# Altium schematic sheet main.SchDoc: Project SHED
size A4; DrawnBy: ultralyj; DocumentNumber: 1; Revision: 0.1; SheetNumber: 1; SheetTotal: 2
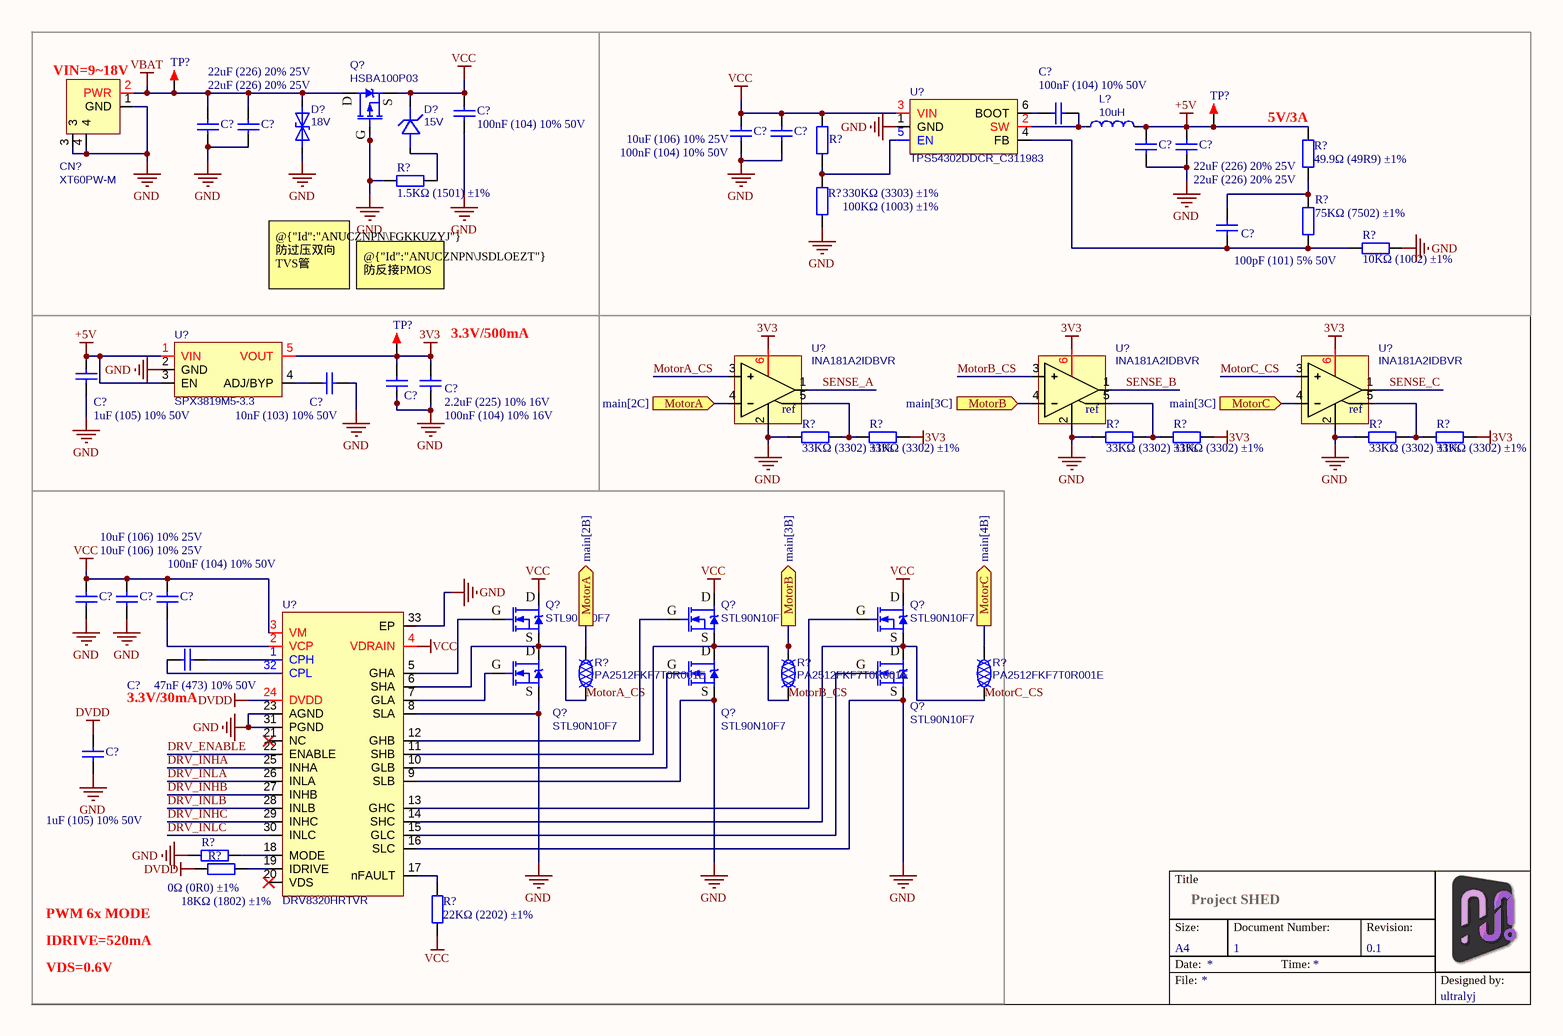
[diagram p0: main.SchDoc]

## Parts
(Parts that share a designator on the sheet are numbered #1, #2 ... from top to bottom, then left to right.)
C?#1  100nF (104) 10% 50V  [0603_C]
C?#2  100nF (104) 10% 50V  [0603_C]
C?#3  22uF (226) 20% 25V  [0805_C]
C?#4  22uF (226) 20% 25V  [0805_C]
C?#5  10uF (106) 10% 25V  [0805_C]
C?#6  100nF (104) 10% 50V  [0603_C]
C?#7  22uF (226) 20% 25V  [0805_C]
C?#8  22uF (226) 20% 25V  [0805_C]
C?#9  100pF (101) 5% 50V  [0402_C]
C?#10  10nF (103) 10% 50V  [0402_C]
C?#11  1uF (105) 10% 50V  [0603_C]
C?#12  100nF (104) 10% 16V  [0402_C]
C?#13  2.2uF (225) 10% 16V  [0603_C]
C?#14  10uF (106) 10% 25V  [0805_C]
C?#15  10uF (106) 10% 25V  [0805_C]
C?#16  100nF (104) 10% 50V  [0603_C]
C?#17  47nF (473) 10% 50V  [0603_C]
C?#18  1uF (105) 10% 50V  [0603_C]
CN?  XT60PW-M  [CONN-TH_XT60PW-M]
D?#1  18V  [SMB_L4.6-W3.6-LS5.3-BI]
D?#2  15V  [SOD-323_L1.8-W1.3-LS2.5-RD]
L?  10uH  [IND-SMD_L5.4-W5.2]
Q?#1  HSBA100P03  [DFN-8_L5.7-W5.1-P1.27-LS6.1-BL]
Q?#2  STL90N10F7  [POWERFLAT-8_L5.2-W6.0-P1.27-LS6.2-BL]
Q?#3  STL90N10F7  [POWERFLAT-8_L5.2-W6.0-P1.27-LS6.2-BL]
Q?#4  STL90N10F7  [POWERFLAT-8_L5.2-W6.0-P1.27-LS6.2-BL]
Q?#5  STL90N10F7  [POWERFLAT-8_L5.2-W6.0-P1.27-LS6.2-BL]
Q?#6  STL90N10F7  [POWERFLAT-8_L5.2-W6.0-P1.27-LS6.2-BL]
Q?#7  STL90N10F7  [POWERFLAT-8_L5.2-W6.0-P1.27-LS6.2-BL]
R?#1  330KΩ (3303) ±1%  [0402_R]
R?#2  49.9Ω (49R9) ±1%  [0402_R]
R?#3  1.5KΩ (1501) ±1%  [0402_R]
R?#4  100KΩ (1003) ±1%  [0402_R]
R?#5  75KΩ (7502) ±1%  [0402_R]
R?#6  10KΩ (1002) ±1%  [0402_R]
R?#7  33KΩ (3302) ±1%  [0402_R]
R?#8  33KΩ (3302) ±1%  [0402_R]
R?#9  33KΩ (3302) ±1%  [0402_R]
R?#10  33KΩ (3302) ±1%  [0402_R]
R?#11  33KΩ (3302) ±1%  [0402_R]
R?#12  33KΩ (3302) ±1%  [0402_R]
R?#13  PA2512FKF7T0R001E  [RES-SMD_L6.4-W3.2_RLP25]
R?#14  PA2512FKF7T0R001E  [RES-SMD_L6.4-W3.2_RLP25]
R?#15  PA2512FKF7T0R001E  [RES-SMD_L6.4-W3.2_RLP25]
R?#16  0Ω (0R0) ±1%  [0402_R]
R?#17  18KΩ (1802) ±1%  [0402_R]
R?#18  22KΩ (2202) ±1%  [0402_R]
TP?#1  TEST  [TEST 1.6]  (value not drawn)
TP?#2  TEST  [TEST 1.6]  (value not drawn)
TP?#3  TEST  [TEST 1.6]  (value not drawn)
U?#1  TPS54302DDCR_C311983  [SOT-23-6_L2.9-W1.6-P0.95-LS2.8-BL]
U?#2  SPX3819M5-3.3  [SOT-23-5_L2.9-W1.6-P0.95-LS2.8-BL]
U?#3  INA181A2IDBVR  [SOT-23-6_L2.9-W1.6-P0.95-LS2.8-BL]
U?#4  INA181A2IDBVR  [SOT-23-6_L2.9-W1.6-P0.95-LS2.8-BL]
U?#5  INA181A2IDBVR  [SOT-23-6_L2.9-W1.6-P0.95-LS2.8-BL]
U?#6  DRV8320HRTVR  [QFN-32_L5.0-W5.0-P0.50-TL-EP3.5]

## Blocks framed on the sheet
VIN=9~18V: C?#2-C?#4 CN? D?#1 D?#2 Q?#1 R?#3 TP?#1
5V/3A: C?#1 C?#5-C?#9 L? R?#1 R?#2 R?#4-R?#6 TP?#2 U?#1
3.3V/500mA: C?#10-C?#13 TP?#3 U?#2

## Ports
MotorA (in, see main[2C]), MotorA (out, see main[2B]), MotorB (in, see main[3C]), MotorB (out, see main[3B]), MotorC (in, see main[3C]), MotorC (out, see main[4B])

## Nets
3V3: C?#12.2 C?#13.2 R?#8.1 R?#10.1 R?#12.1 TP?#3.1 U?#2.5(VOUT) U?#3.6(VS) U?#4.6(VS) U?#5.6(VS)
+5V: C?#7.2 C?#8.2 C?#11.2 L?.2 R?#2.2 TP?#2.1 U?#2.1(VIN) U?#2.3(EN)
DVDD: C?#18.2 R?#17.1 U?#6.24(DVDD)
GND: C?#2.1 C?#3.1 C?#4.1 C?#5.1 C?#6.1 C?#7.1 C?#8.1 C?#10.2 C?#11.1 C?#12.1 C?#13.1 C?#14.1 C?#15.1 C?#18.1 CN?.1(GND) CN?.3 CN?.4 D?#1.1 Q?#1.4(G) Q?#5.1,2,3(S) Q?#6.1,2,3(S) Q?#7.1,2,3(S) R?#3.1 R?#4.1 R?#6.1 R?#7.2 R?#9.2 R?#11.2 R?#16.1 U?#1.1(GND) U?#2.2(GND) U?#3.2(GND) U?#4.2(GND) U?#5.2(GND) U?#6.8(SLA) U?#6.9(SLB) U?#6.16(SLC) U?#6.23(AGND) U?#6.31(PGND) U?#6.33(EP)
VBAT: C?#3.2 C?#4.2 CN?.2(PWR) D?#1.2 Q?#1.5,6,7,8,9(D) TP?#1.1
VCC: C?#2.2 C?#5.2 C?#6.2 C?#14.2 C?#15.2 C?#16.2 D?#2.1 Q?#1.1,2,3(S) Q?#2.5,6,7,8(D) Q?#3.5,6,7,8(D) Q?#4.5,6,7,8(D) R?#1.2 R?#18.2 U?#1.3(VIN) U?#6.3(VM) U?#6.4(VDRAIN)
DRV_ENABLE: U?#6.22(ENABLE)
DRV_INHA: U?#6.25(INHA)
DRV_INHB: U?#6.27(INHB)
DRV_INHC: U?#6.29(INHC)
DRV_INLA: U?#6.26(INLA)
DRV_INLB: U?#6.28(INLB)
DRV_INLC: U?#6.30(INLC)
MotorA: R?#13.2 U?#3.4(IN-) ; port MotorA
MotorA_CS: Q?#2.1,2,3(S) Q?#5.5,6,7,8(D) R?#13.1 U?#3.3(IN+) U?#6.6(SHA)
MotorB: R?#14.2 U?#4.4(IN-) ; port MotorB
MotorB_CS: Q?#3.1,2,3(S) Q?#6.5,6,7,8(D) R?#14.1 U?#4.3(IN+) U?#6.11(SHB)
MotorC: R?#15.1 U?#5.4(IN-) ; port MotorC
MotorC_CS: Q?#4.1,2,3(S) Q?#7.5,6,7,8(D) R?#15.2 U?#5.3(IN+) U?#6.14(SHC)
SENSE_A: U?#3.1(OUT)
SENSE_B: U?#4.1(OUT)
SENSE_C: U?#5.1(OUT)
NetC?#1_1: C?#1.1 U?#1.6(BOOT)
NetC?#1_2: C?#1.2 L?.1 U?#1.2(SW)
NetC?#9_1: C?#9.1 R?#5.1 R?#6.2 U?#1.4(FB)
NetC?#9_2: C?#9.2 R?#2.1 R?#5.2
NetC?#10_1: C?#10.1 U?#2.4(ADJ/BYP)
NetC?#16_1: C?#16.1 U?#6.2(VCP)
NetC?#17_1: C?#17.1 U?#6.32(CPL)
NetC?#17_2: C?#17.2 U?#6.1(CPH)
NetD?#2_2: D?#2.2 R?#3.2
NetQ?#2_4: Q?#2.4(G) U?#6.5(GHA)
NetQ?#3_4: Q?#3.4(G) U?#6.12(GHB)
NetQ?#4_4: Q?#4.4(G) U?#6.13(GHC)
NetQ?#5_4: Q?#5.4(G) U?#6.7(GLA)
NetQ?#6_4: Q?#6.4(G) U?#6.10(GLB)
NetQ?#7_4: Q?#7.4(G) U?#6.15(GLC)
NetR?#1_1: R?#1.1 R?#4.2 U?#1.5(EN)
NetR?#7_1: R?#7.1 R?#8.2 U?#3.5(REF)
NetR?#9_1: R?#9.1 R?#10.2 U?#4.5(REF)
NetR?#11_1: R?#11.1 R?#12.2 U?#5.5(REF)
NetR?#16_2: R?#16.2 U?#6.18(MODE)
NetR?#17_2: R?#17.2 U?#6.19(IDRIVE)
NetR?#18_1: R?#18.1 U?#6.17(nFAULT)

Not connected (* = marked no-connect by the designer): U?#6 20(VDS)* 21(NC)*

## Notes on the sheet
- @{"Id":"ANUCZNPN\FGKKUZYJ"} 防过压双向TVS管
- @{"Id":"ANUCZNPN\JSDLOEZT"} 防反接PMOS
- (near C?#17) 3.3V/30mA
- PWM 6x MODE
- IDRIVE=520mA
- VDS=0.6V
- Title
- Size:
- A4
- Date:
- File:
- Document Number:
- Time:
- Revision:
- Designed by:
- (in symbol INA181A2IDBVR) ref

## Library data of the parts
C?#1 C?#2 C?#6 C?#16 = 0603 100nF (104) 10% 50V: 贴片电容; ComponentLink1Description: 供应商链接; ComponentLink1URL: http://www.szlcsc.com/product/details_15331.html; Package: 0603; Supplier: LC; SuppliersPartNumber: C14663
C?#3 C?#4 C?#7 C?#8 = 0805 22uF (226) 20% 25V: 贴片电容; ComponentLink1Description: 供应商链接; ComponentLink1URL: http://www.szlcsc.com/product/details_46786.html; Package: 0805; Supplier: LC; SuppliersPartNumber: C45783
C?#5 C?#14 C?#15 = 0805 10uF (106) 10% 25V: 贴片电容; ComponentLink1Description: 供应商链接; ComponentLink1URL: http://www.szlcsc.com/product/details_16532.html; Package: 0805; Supplier: LC; SuppliersPartNumber: C15850
C?#9 = 0402 100pF (101) 5% 50V: 贴片电容; ComponentLink1Description: 供应商链接; ComponentLink1URL: http://www.szlcsc.com/product/details_1898.html; Package: 0402; Supplier: LC; SuppliersPartNumber: C1546
C?#10 = 0402 10nF (103) 10% 50V: 贴片电容; ComponentLink1Description: 供应商链接; ComponentLink1URL: http://www.szlcsc.com/product/details_15869.html; Package: 0402; Supplier: LC; SuppliersPartNumber: C15195
C?#11 C?#18 = 0603 1uF (105) 10% 50V: 贴片电容; ComponentLink1Description: 供应商链接; ComponentLink1URL: http://www.szlcsc.com/product/details_16531.html; Package: 0603; Supplier: LC; SuppliersPartNumber: C15849
C?#12 = 0402 100nF (104) 10% 16V: 贴片电容; ComponentLink1Description: 供应商链接; ComponentLink1URL: http://www.szlcsc.com/product/details_1877.html; Package: 0402; Supplier: LC; SuppliersPartNumber: C1525
C?#13 = 0603 2.2uF (225) 10% 16V: 贴片电容; ComponentLink1Description: 供应商链接; ComponentLink1URL: http://www.szlcsc.com/product/details_24366.html; Package: 0603; Supplier: LC; SuppliersPartNumber: C23630
C?#17 = 0603 47nF (473) 10% 50V: 贴片电容; ComponentLink1Description: 供应商链接; ComponentLink1URL: http://www.szlcsc.com/product/details_1974.html; Package: 0603; Supplier: LC; SuppliersPartNumber: C1622
CN? = XT60PW-M: 电源插座; BOM_Manufacturer: AMASS(艾迈斯); Contributor: LCSC; BOM_Supplier: LCSC; BOM_Supplier Part: C98732; BOM_Manufacturer Part: XT60PW-M; BOM_JLCPCB Part Class: Extended Part; spicePre: C; spiceSymbolName: XT60PW-M
D?#1 = SMBJ18CA-C78413: 双向18V TVS管; BOM_Manufacturer Part: SMBJ18CA/TR13; BOM_Manufacturer: Brightking(君耀电子); BOM_Supplier: LCSC; BOM_Supplier Part: C78413; BOM_JLCPCB Part Class: Extended Part; spicePre: D; spiceSymbolName: SMBJ18CA-C78413
D?#2 = PTVSHC3D15VUH: 15V TVS管; BOM_Manufacturer: Prisemi(芯导); Contributor: LCSC; BOM_Supplier: LCSC; BOM_Supplier Part: C312234; BOM_Manufacturer Part: PTVSHC3D15VUH; BOM_JLCPCB Part Class: Extended Part; spicePre: D; spiceSymbolName: PTVSHC3D15VUH
L? = 10uH: YSPI0530-100M 2.5A功率电感; BOM_Manufacturer: YJYCOIN(益嘉源); nameAlias: Inductance; Contributor: LCSC; BOM_Supplier: LCSC; BOM_Supplier Part: C351099; BOM_Manufacturer Part: YSPI0530-100M; BOM_JLCPCB Part Class: Extended Part; spicePre: L; spiceSymbolName: YSPI0530-100M
Q?#1 = HSBA100P03: P-Channel Mosfet Vdss=30V Id=100A; BOM_Manufacturer: HUASHUO(华朔); Contributor: LCSC; BOM_Supplier: LCSC; BOM_Supplier Part: C701057; BOM_Manufacturer Part: HSBA100P03; BOM_JLCPCB Part Class: Extended Part; spicePre: Q; spiceSymbolName: HSBA100P03
Q?#2-Q?#7 = STL90N10F7: N-Channel Mosfet Vdss=100V Id=70A; BOM_Manufacturer: ST(意法半导体); Contributor: LCSC; BOM_Supplier: LCSC; BOM_Supplier Part: C457493; BOM_Manufacturer Part: STL90N10F7; BOM_JLCPCB Part Class: Extended Part; spicePre: Q; spiceSymbolName: STL90N10F7
R?#1 = 0402 330KΩ (3303) 1%: 贴片电阻; ComponentLink1Description: 供应商链接; ComponentLink1URL: http://www.szlcsc.com/product/details_26521.html; Package: 0402; Supplier: LC; SuppliersPartNumber: C25778
R?#2 = 0402 49.9Ω (49R9) 1%: 贴片电阻; ComponentLink1Description: 供应商链接; ComponentLink1URL: http://www.szlcsc.com/product/details_25863.html; Package: 0402; Supplier: LC; SuppliersPartNumber: C25120
R?#3 = 0402 1.5KΩ (1501) 1%: 贴片电阻; ComponentLink1Description: 供应商链接; ComponentLink1URL: http://www.szlcsc.com/product/details_26610.html; Package: 0402; Supplier: LC; SuppliersPartNumber: C25867
R?#4 = 0402 100KΩ (1003) 1%: 贴片电阻; ComponentLink1Description: 供应商链接; ComponentLink1URL: http://www.szlcsc.com/product/details_26484.html; Package: 0402; Supplier: LC; SuppliersPartNumber: C25741
R?#5 = 0402 75KΩ (7502) 1%: 贴片电阻; ComponentLink1Description: 供应商链接; ComponentLink1URL: http://www.szlcsc.com/product/details_26541.html; Package: 0402; Supplier: LC; SuppliersPartNumber: C25798
R?#6 = 0402 10KΩ (1002) 1%: 贴片电阻; ComponentLink1Description: 供应商链接; ComponentLink1URL: http://www.szlcsc.com/product/details_26487.html; Package: 0402; Supplier: LC; SuppliersPartNumber: C25744
R?#7-R?#12 = 0402 33KΩ (3302) 1%: 贴片电阻; ComponentLink1Description: 供应商链接; ComponentLink1URL: http://www.szlcsc.com/product/details_26522.html; Package: 0402; Supplier: LC; SuppliersPartNumber: C25779
R?#13-R?#15 = PA2512FKF7T0R001E: 0.01欧姆采样电阻 3W; BOM_Manufacturer: YAGEO(国巨); Contributor: lcsc; BOM_Supplier: LCSC; BOM_Supplier Part: C723380; BOM_Manufacturer Part: PA2512FKF7T0R001E; Resistance: -; BOM_JLCPCB Part Class: Extended Part; spicePre: R; spiceSymbolName: PA2512FKF7T0R001E
R?#16 = 0402 0Ω (0R0) 1%: 贴片电阻; ComponentLink1Description: 供应商链接; ComponentLink1URL: http://www.szlcsc.com/product/details_17853.html; Package: 0402; Supplier: LC; SuppliersPartNumber: C17168
R?#17 = 0402 18KΩ (1802) 1%: 贴片电阻; ComponentLink1Description: 供应商链接; ComponentLink1URL: http://www.szlcsc.com/product/details_26505.html; Package: 0402; Supplier: LC; SuppliersPartNumber: C25762
R?#18 = 0402 22KΩ (2202) 1%: 贴片电阻; ComponentLink1Description: 供应商链接; ComponentLink1URL: http://www.szlcsc.com/product/details_26511.html; Package: 0402; Supplier: LC; SuppliersPartNumber: C25768
TP?#1-TP?#3 = TEST: 测试点; 版权归属: 源创客; BOM名称: 测试点; 学习资源: www.ooocke.com
U?#1 = TPS54302DDCR_C311983: DC-DC芯片 Vin=4.5V~28V Vout=596mV~28V Imax=3A; BOM_Manufacturer: TI(德州仪器); Contributor: LCSC; BOM_Supplier: LCSC; BOM_Supplier Part: C311983; BOM_Manufacturer Part: TPS54302DDCR; BOM_JLCPCB Part Class: Extended Part; spicePre: U; spiceSymbolName: TPS54302DDCR_C311983
U?#2 = SPX3819M5-3.3: Vin=16V Vout=3.3V 500mA LDO; BOM_Manufacturer: null; Contributor: lcsc; BOM_Supplier: LCSC; BOM_Supplier Part: C9900018941; BOM_Manufacturer Part: SPX3819M5-3.3; BOM_JLCPCB Part Class: Extended Part; spicePre: U; spiceSymbolName: SPX3819M5-3.3
U?#3-U?#5 = INA181A2IDBVR: 26V、双向、350kHz 电流感应放大器; BOM_Manufacturer: TI(德州仪器); Contributor: lcsc; BOM_Supplier: LCSC; BOM_Supplier Part: C2058784; BOM_Manufacturer Part: INA181A2IDBVR; BOM_JLCPCB Part Class: Extended Part; spicePre: U; spiceSymbolName: INA181A2IDBVR
U?#6 = DRV8320HRTVR: 最大 65V 三相智能栅极驱动器; BOM_Manufacturer: TI(德州仪器); Contributor: LCSC; BOM_Supplier: LCSC; BOM_Supplier Part: C701782; BOM_Manufacturer Part: DRV8320HRTVR; BOM_JLCPCB Part Class: Extended Part; spicePre: U; spiceSymbolName: DRV8320HRTVR